# EAGLE design Board (EAGLE 9.0.0)
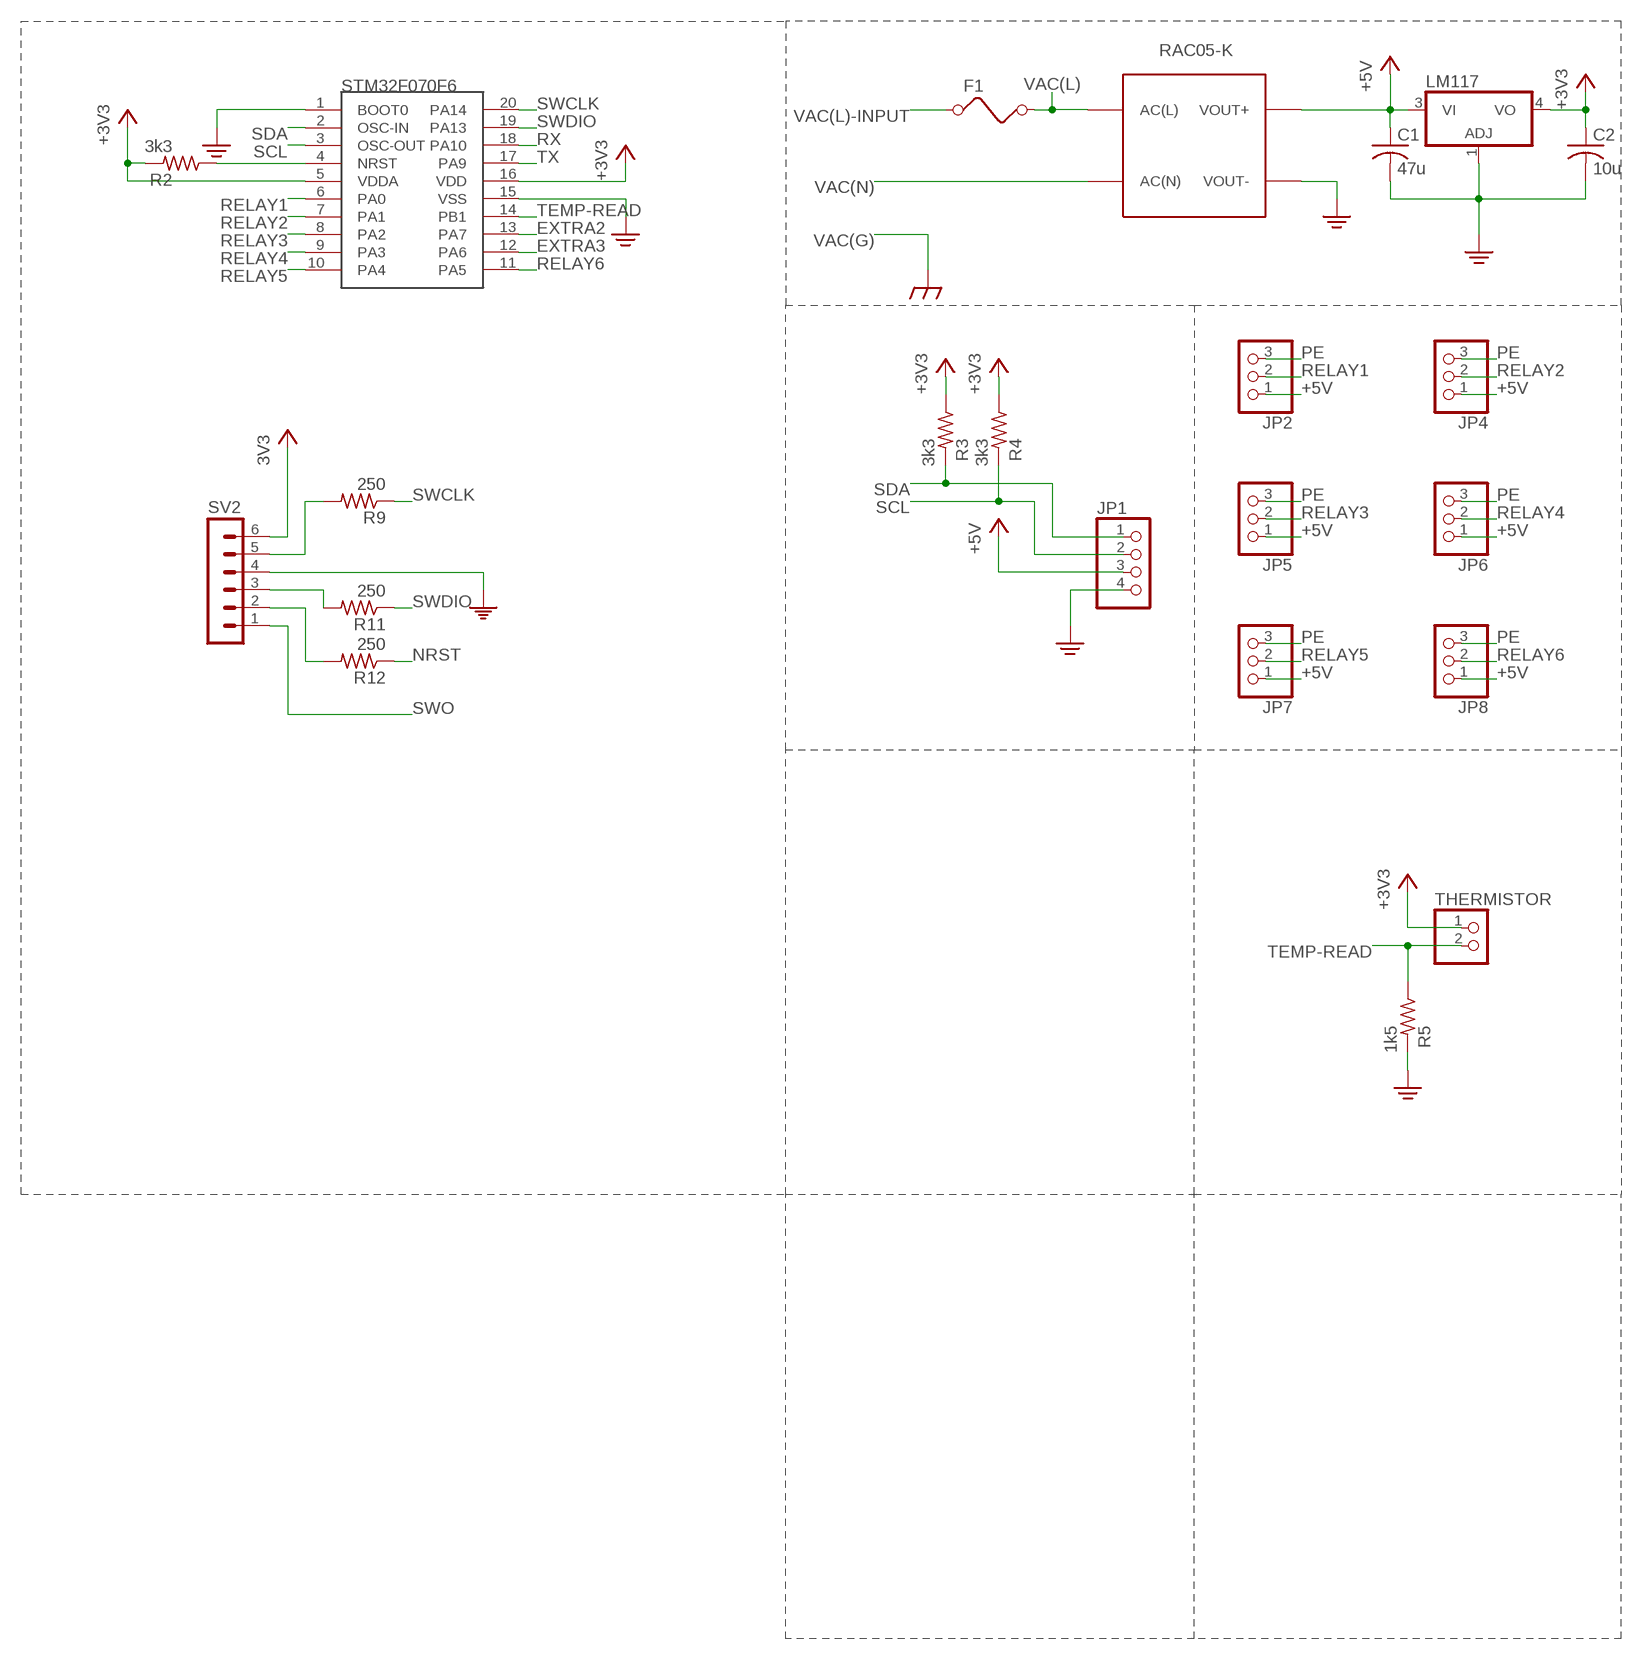
[diagram p0: schematic, sheet 1]

## Parts
C1  47u  C-USC0603  [C0603]
C2  10u  C-USC0603  [C0603]
F1  FUSE  [FUSE]
JP1  PINHD-1X4  [1X04]
JP2  PINHD-1X3  [1X03]
JP4  PINHD-1X3  [1X03]
JP5  PINHD-1X3  [1X03]
JP6  PINHD-1X3  [1X03]
JP7  PINHD-1X3  [1X03]
JP8  PINHD-1X3  [1X03]
LM117  317EMP  [SOT223]
R2  3k3  R-US_R0603  [R0603]
R3  3k3  R-US_R0603  [R0603]
R4  3k3  R-US_R0603  [R0603]
R5  1k5  R-US_R0603  [R0603]
R9  250  R-US_R0603  [R0603]
R11  250  R-US_R0603  [R0603]
R12  250  R-US_R0603  [R0603]
RAC05-K  AC/DC-CONVERTER  [AC/DC-CONVERTER]
STM32F070F6  STM32F07  [TSSOP20]
SV2  MA06-1  [MA06-1]
THERMISTOR  PINHD-1X2  [1X02]

## Nets
+3V3: C2.1 LM117.4(VO) R2.2 R3.1 R4.1 STM32F070F6.5(VDDA) STM32F070F6.16(VDD) SV2.6 THERMISTOR.1 ; supply symbol labelled 3V3
+5V: C1.1 JP1.3 JP2.1 JP4.1 JP5.1 JP6.1 JP7.1 JP8.1 LM117.3(VI) RAC05-K.+5V(VOUT+)
EXTRA2: STM32F070F6.13(PA7)
EXTRA3: STM32F070F6.12(PA6)
GND: SV2.4
N$19: R9.2 SV2.5
N$21: R11.2 SV2.3
N$22: R12.2 SV2.2
NRST: R2.1 R12.1 STM32F070F6.4(NRST)
PE: C1.2 C2.2 JP1.4 JP2.3 JP4.3 JP5.3 JP6.3 JP7.3 JP8.3 LM117.1(ADJ) R5.2 RAC05-K.GND(VOUT-) STM32F070F6.1(BOOT0) STM32F070F6.15(VSS)
RELAY1: JP2.2 STM32F070F6.6(PA0)
RELAY2: JP4.2 STM32F070F6.7(PA1)
RELAY3: JP5.2 STM32F070F6.8(PA2)
RELAY4: JP6.2 STM32F070F6.9(PA3)
RELAY5: JP7.2 STM32F070F6.10(PA4)
RELAY6: JP8.2 STM32F070F6.11(PA5)
RX: STM32F070F6.18(PA10)
SCL: JP1.2 R4.2 STM32F070F6.3(OSC-OUT)
SDA: JP1.1 R3.2 STM32F070F6.2(OSC-IN)
SWCLK: R9.1 STM32F070F6.20(PA14)
SWDIO: R11.1 STM32F070F6.19(PA13)
SWO: SV2.1
TEMP-READ: R5.1 STM32F070F6.14(PB1) THERMISTOR.2
TX: STM32F070F6.17(PA9)
VAC(L): F1.2 RAC05-K.L(AC(L))
VAC(L)-INPUT: F1.1
VAC(N): RAC05-K.N(AC(N))

## Library data of the parts
C1 C2 = rcl:C-US: CAPACITOR, American symbol; SPICEPREFIX: C
F1 = special:FUSE: FUSE 5 x 20 mm
JP1 = pinhead:PINHD-1X4: PIN HEADER
JP2 JP4-JP8 = pinhead:PINHD-1X3: PIN HEADER
LM117 = linear:*317: Positive VOLTAGE REGULATOR
R2-R5 R9 R11 R12 = rcl:R-US_: RESISTOR, American symbol; SPICEPREFIX: R
RAC05-K = SousVide Library:AC/DC-CONVERTER
STM32F070F6 = SousVide Library:STM32F07
SV2 = con-lstb:MA06-1: PIN HEADER; OC_FARNELL: unknown; OC_NEWARK: unknown
THERMISTOR = pinhead:PINHD-1X2: PIN HEADER

## Net classes
0 default: width 0.254 mm, drill 0.254 mm, clearance 0.762 mm

## Board
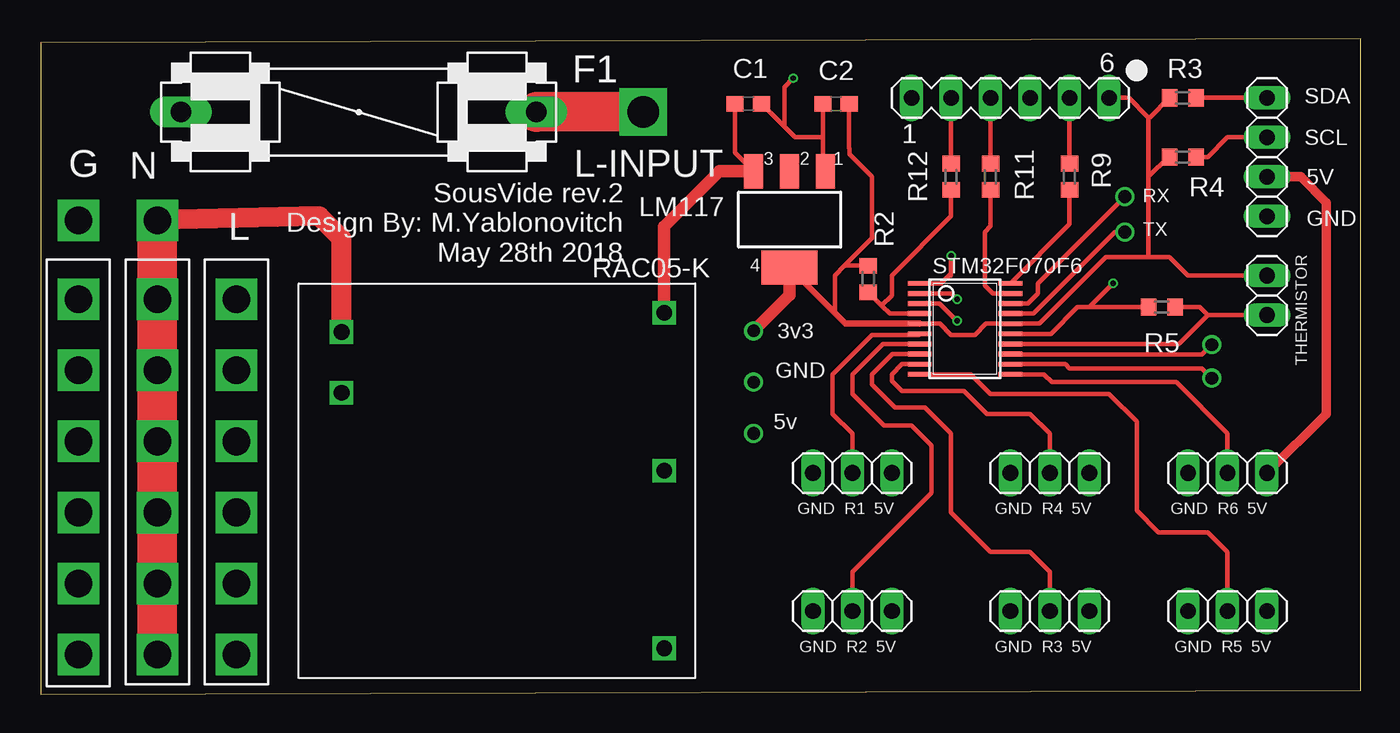
[diagram p1: board, top side]
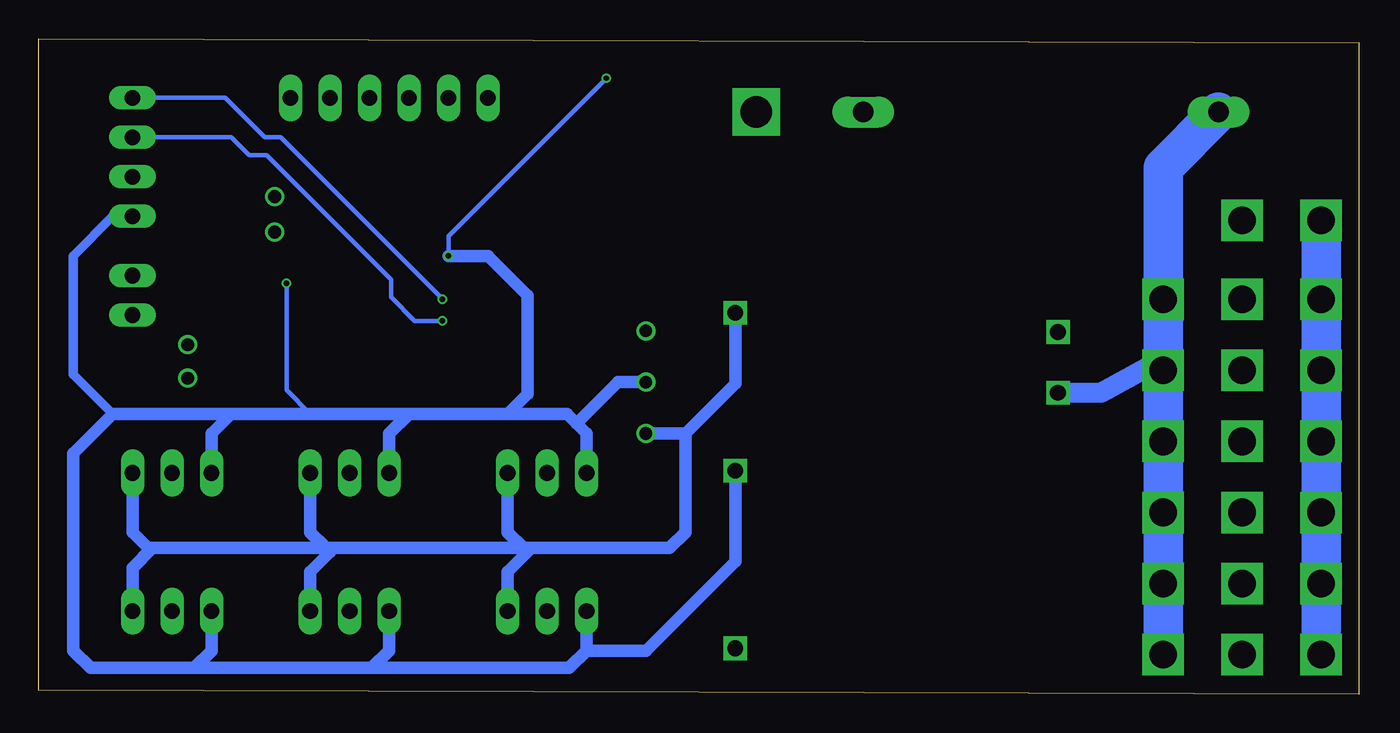
[diagram p2: board, bottom side, seen from below]

Size 84.89 x 42.15 mm. Coordinates in mm from the lower left corner, seen from the top.
Outline: 0,0 84.89,0.25 84.89,42.15 0,41.9 0,0
Copper layers (1*16): Top 0.035559375mm / dielectric 1.6mm / Bottom 0.035559375mm
Design rules "oshpark-2layer": minimum track width 6mil, minimum drill 10mil, track to track 6mil, track to pad 6mil, pad to pad 6mil, via to via 6mil, smd to smd 6mil, copper to edge 15mil, drill to drill 6mil, minimum pad ring 5mil, minimum via ring 5mil, stop-mask expansion 2.5mil, vias tented up to drill 0mil, thermal gap 10mil

### Footprints (pad centres in the part's own frame; a part is rotated, then mirrored left to right if it is on the bottom)
C0603 = smd 1.1 x 1: 1 -0.85,0; 2 0.85,0
FUSE = drill 1.321 long: 1 -11.43,0; 2 11.43,0
1X04 = drill 1.016 long: 1 -3.81,0; 2 -1.27,0; 3 1.27,0; 4 3.81,0
1X03 = drill 1.016 long: 1 -2.54,0; 2 0,0; 3 2.54,0
SOT223 = smd 1.219 x 2.235: 1 -2.311,-3.099; 2 0,-3.099; 3 2.311,-3.099 | smd 3.6 x 2.2: 4 0,3.099
R0603 = smd 1 x 1.1: 1 -0.85,0; 2 0.85,0
AC/DC-CONVERTER = drill 1.016 square: +5V 10.76,10.815; GND 10.76,0.655; L -10,5.67; N -10,9.57; NC 10.76,-10.775
TSSOP20 = smd 0.305 x 1.524: 1 -2.925,-2.918; 2 -2.275,-2.918; 3 -1.625,-2.918; 4 -0.975,-2.918; 5 -0.325,-2.918; 6 0.325,-2.918; 7 0.975,-2.918; 8 1.625,-2.918; 9 2.275,-2.918; 10 2.925,-2.918; 11 2.925,2.918; 12 2.275,2.918; 13 1.625,2.918; 14 0.975,2.918; 15 0.325,2.918; 16 -0.325,2.918; 17 -0.975,2.918; 18 -1.625,2.918; 19 -2.275,2.918; 20 -2.925,2.918
MA06-1 = drill 1.016 long: 1 -6.35,0; 2 -3.81,0; 3 -1.27,0; 4 1.27,0; 5 3.81,0; 6 6.35,0
1X02 = drill 1.016 long: 1 -1.27,0; 2 1.27,0

### Placement (x,y rotation side)
C1  45.51,37.97 0 top
C2  51.14,37.97 180 top
F1  20.45,37.44 180 top
JP1  78.87,34.54 270 top
JP2  52.2,14.22 180 top
JP4  52.2,5.33 180 top
JP5  64.9,5.33 180 top
JP6  64.9,14.22 180 top
JP7  76.33,5.33 180 top
JP8  76.33,14.22 180 top
LM117  48.16,30.53 180 top
R2  53.21,26.71 90 top
R3  73.44,38.35 0 top
R4  73.44,34.54 0 top
R5  72.1,24.89 180 top
R9  66.17,33.27 90 top
R11  61.09,33.27 90 top
R12  58.55,33.27 90 top
RAC05-K  29.34,13.72 0 top
STM32F070F6  59.44,23.5 270 top
SV2  62.36,38.35 0 top
THERMISTOR  78.87,25.65 270 top

### Tracks (layer width: path | path; a pad name or v marks a point on that pad's centre or on a via)
+3V3  (via drill 0.81)
  Top 0.305: THERMISTOR.1 73.79,26.92 72.59,28.12 71.25,28.12 | 71.25,28.12 68.5,28.12 64.21,23.82 STM32F070F6.16 60.78,23.82 60.07,23.11 58.55,23.11 57.84,23.82 STM32F070F6.5 | 51.07,24.52 51.07,26.94 51.69,27.56 | 51.69,27.56 R2.2 | C2.1 51.99,35.13 51.99,34.75 53.47,33.27 53.47,29.34 51.69,27.56 | 71.25,28.12 71.25,33.27 | 71.25,33.27 72.52,34.54 R4.1 | 71.25,33.27 71.25,37.08 | 71.25,37.08 71.33,37.08 R3.1 | 71.25,37.08 69.98,38.35 SV2.6
  Top 0.406: STM32F070F6.5 51.77,23.82 51.07,24.52 LM117.4
  Top 0.813: LM117.4 48.16,25.68 v45.85,23.37
+5V  (via drill 0.81)
  Top 0.305: C1.1 44.66,34.82 LM117.3
  Top 0.61: JP1.3 81.03,33.27 82.68,31.62 82.68,18.03 JP8.1
  Top 0.813: LM117.3 43.66,33.63 40.1,30.06 RAC05-K.+5V
  Bottom 0.813: JP4.1 54.74,7.87 53.21,9.4 | 53.21,9.4 44.32,9.4 43.31,10.41 43.31,16.76 | 53.21,9.4 53.72,9.4 | 53.72,9.4 54.74,10.41 JP2.1 | JP6.1 67.44,10.41 66.42,9.4 | 66.42,9.4 66.17,9.14 67.44,7.87 JP5.1 | 53.72,9.4 66.42,9.4 | 66.42,9.4 77.6,9.4 | 77.6,9.4 77.85,9.4 78.87,10.41 JP8.1 | 77.6,9.4 78.87,8.13 JP7.1 | RAC05-K.+5V 40.1,19.97 43.31,16.76 | 43.31,16.76 v45.85,16.76
EXTRA2  (via drill 0.81)
  Top 0.305: STM32F070F6.13 62.39,21.84 74.68,21.84 v75.31,22.48
EXTRA3  (via drill 0.81)
  Top 0.305: STM32F070F6.12 65.9,21.22 66.17,20.95 74.68,20.95 v75.31,20.32
N$19
  Top 0.305: SV2.5 R9.2
N$21
  Top 0.305: SV2.3 R11.2
N$22
  Top 0.305: SV2.2 R12.2
NRST
  Top 0.305: 54.08,24.99 54.6,24.47 STM32F070F6.4 | 54.08,24.99 R2.1 | 54.08,24.99 54.74,25.65 54.74,26.92 58.55,30.73 R12.1
PE  (via drill 0.35, 0.81)
  Top 0.305: R5.2 67.44,24.89 | 67.44,24.89 66.67,24.89 64.96,23.17 STM32F070F6.15 | C2.2 50.29,35.81 | 50.29,35.81 50.29,33.91 50.93,33.27 | C1.2 47.82,36.51 | 47.82,36.51 48.51,35.81 50.29,35.81 | 47.82,36.51 47.82,39.05 v48.39,39.62 | STM32F070F6.1 57.9,26.42 58.55,27.07 | v58.55,28.19 58.55,27.07 | 58.55,26.94 58.55,27.07 | 67.44,24.89 v68.96,26.42
  Top 0.61: LM117.1 50.47,33.73 50.29,33.91
  Bottom 0.305: v48.39,39.62 58.55,29.46 v58.55,28.19 | v68.96,26.42 68.96,19.56 67.44,18.03
  Bottom 0.61: JP1.4 80.14,30.73 82.68,28.19 82.68,20.57 80.14,18.03
  Bottom 0.813: JP4.3 49.66,2.79 | 49.66,2.79 50.77,1.68 63.48,1.68 | 63.48,1.68 74.91,1.68 | 74.91,1.68 81.56,1.68 82.68,2.79 82.68,15.49 80.14,18.03 72.52,18.03 | JP5.3 62.36,2.79 63.48,1.68 | JP7.3 73.79,2.79 74.91,1.68 | 72.52,18.03 67.44,18.03 61.09,18.03 | 61.09,18.03 54.74,18.03 | 54.74,18.03 50.93,18.03 50.29,17.4 | JP2.3 49.66,16.76 50.29,17.4 | JP6.3 62.36,16.76 61.09,18.03 | JP8.3 73.79,16.76 72.52,18.03 | v58.55,28.19 56.01,28.19 53.47,25.65 53.47,19.3 54.74,18.03 | 49.66,2.79 45.85,2.79 40.1,8.54 RAC05-K.GND | 50.29,17.4 47.62,20.07 v45.85,20.07
RELAY1
  Top 0.305: STM32F070F6.6 56.46,23.11 53.47,23.11 50.93,20.57 50.93,18.03 52.2,16.76 JP2.2
RELAY2
  Top 0.305: STM32F070F6.7 54.15,22.52 52.2,20.57 52.2,19.3 54.23,17.27 56.01,17.27 57.28,16 57.28,12.95 52.2,7.87 JP4.2
RELAY3
  Top 0.305: STM32F070F6.8 54.77,21.87 53.47,20.57 53.47,19.91 54.94,18.44 56.87,18.44 58.55,16.76 58.55,11.68 61.09,9.14 63.63,9.14 64.9,7.87 JP5.2
RELAY4
  Top 0.305: STM32F070F6.9 55.39,21.22 54.74,20.57 54.74,20.15 55.38,19.51 59.38,19.51 60.85,18.03 63.63,18.03 64.9,16.76 JP6.2
RELAY5
  Top 0.305: JP7.2 76.33,9.14 75.06,10.41 71.88,10.41 70.48,11.81 70.48,17.53 68.71,19.3 61.09,19.3 59.82,20.57 STM32F070F6.10
RELAY6
  Top 0.305: JP8.2 76.33,16.76 73.03,20.07 65.02,20.07 64.52,20.57 STM32F070F6.11
RX  (via drill 0.81)
  Top 0.305: STM32F070F6.18 63.48,25.12 64.13,25.78 64.13,26.42 68.58,30.86 68.83,31.12 v69.72,32
SCL  (via drill 0.35)
  Top 0.305: STM32F070F6.3 57.81,25.12 v58.93,24 | JP1.2 76.33,35.81 75.06,34.54 R4.2
  Bottom 0.305: v58.93,24 60.71,24 62.23,25.53 62.23,26.67 70.23,34.67 71.37,34.67 72.52,35.81 JP1.2
SDA  (via drill 0.35)
  Top 0.305: STM32F070F6.2 58.55,25.77 v58.93,25.4 | JP1.1 R3.2
  Bottom 0.305: v58.93,25.4 69.34,35.81 70.36,35.81 72.9,38.35 JP1.1
SWCLK
  Top 0.305: STM32F070F6.20 66.17,30.23 R9.1
SWDIO
  Top 0.305: STM32F070F6.19 61.22,25.77 60.71,26.29 60.71,29.72 61.09,30.1 R11.1
TEMP-READ
  Top 0.305: THERMISTOR.2 75.06,24.38 | STM32F070F6.14 73.2,22.52 75.06,24.38 | R5.1 74.55,24.89 75.06,24.38
TX  (via drill 0.81)
  Top 0.305: STM32F070F6.17 63.84,24.47 69.09,29.72 v69.72,29.72
VAC(G)  (via drill 1.78)
  Bottom 2.54: v2.41,30.48 v2.41,25.4 v2.41,20.83 v2.41,16.26 v2.41,11.68 v2.41,7.11 v2.41,2.54
VAC(L)  (via drill 1.78)
  Bottom 1.27: RAC05-K.L 16.55,19.39 12.57,21.59
  Bottom 2.54: v12.57,7.11 v12.57,16.26 v12.57,20.83 12.57,21.59 v12.57,25.4 12.57,33.88 F1.2 | v12.57,11.68 v12.57,7.11 | v12.57,2.54 v12.57,7.11
VAC(L)-INPUT  (via drill 2.03)
  Top 2.54: v38.73,37.47 31.9,37.47 F1.1
VAC(N)  (via drill 1.78)
  Top 1.27: RAC05-K.N 19.34,29.3 17.91,30.73 v7.49,30.48
  Top 2.54: v7.49,2.54 v7.49,7.11 v7.49,16.26 | v7.49,30.48 v7.49,25.4 v7.49,20.83 v7.49,16.26 | v7.49,11.68 v7.49,16.26

### Text on the board
tPlace: SDA | SCL | G | N | L-INPUT | SousVide rev.2 / Design By: M.Yablonovitch / May 28th 2018 | 5V | RX | TX | GND | L | 3v3 | GND | 5v | GND R1 5V | GND R4 5V | GND R6 5V | GND R2 5V | GND R3 5V | GND R5 5V